# EAGLE schematic fesz_boundary_value_meter (EAGLE 6.5.0)
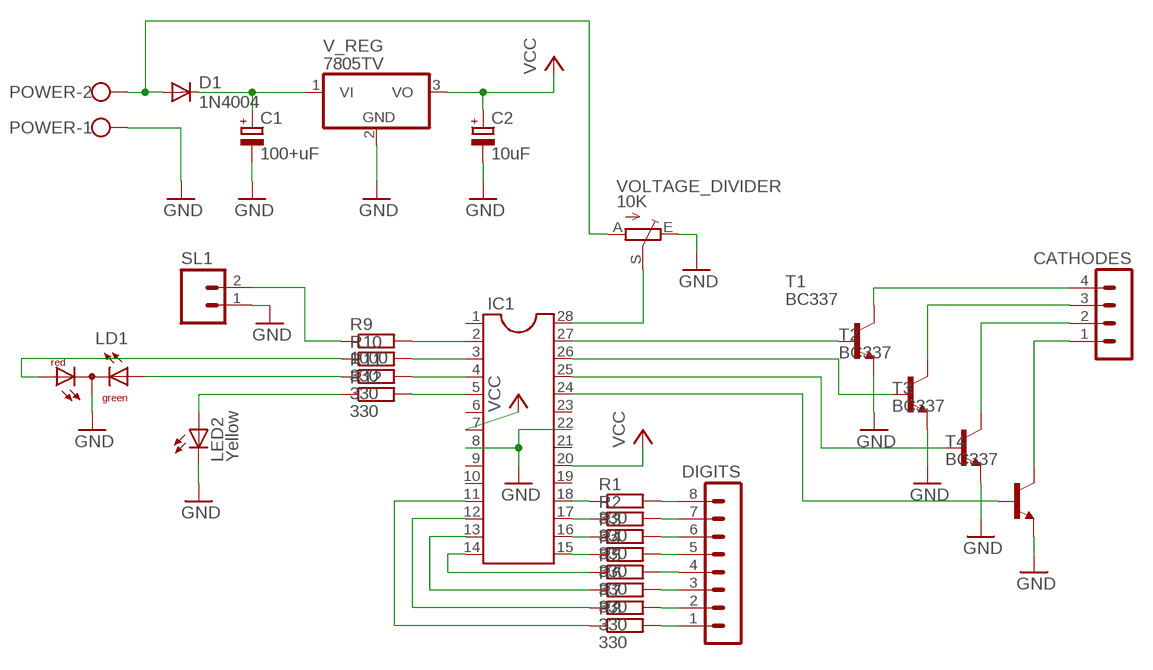
[diagram p0: schematic, sheet 1]

## Parts
C1  100+uF  CPOL-EUE2.5-6  [E2,5-6]
C2  10uF  CPOL-EUE2,5-6E  [E2,5-6E]
CATHODES  MA04-1  [MA04-1]
D1  1N4004  [DO41-10]
DIGITS  MA08-1  [MA08-1]
IC1  DIL28-3  [DIL28-3]
LD1  DUOLED-RG-C  [DUOLED-C-5MM]
LED2  Yellow  LED3MM  [LED3MM]
POWER  W237-102  [W237-102]
R1  330  R-EU_0207/10  [0207/10]
R2  330  R-EU_0207/10  [0207/10]
R3  330  R-EU_0207/10  [0207/10]
R4  330  R-EU_0207/10  [0207/10]
R5  330  R-EU_0207/10  [0207/10]
R6  330  R-EU_0207/10  [0207/10]
R7  330  R-EU_0207/10  [0207/10]
R8  330  R-EU_0207/10  [0207/10]
R9  1000  R-EU_0207/10  [0207/10]
R10  330  R-EU_0207/10  [0207/10]
R11  330  R-EU_0207/10  [0207/10]
R12  330  R-EU_0207/10  [0207/10]
SL1  MA02  [02PA]
T1  BC337  [TO92]
T2  BC337  [TO92]
T3  BC337  [TO92]
T4  BC337  [TO92]
V_REG  7805TV  [TO220V]
VOLTAGE_DIVIDER  10K  TRIM_EU-S64W  [S64W]

## Nets
DIGIT_1_1: IC1.18 R1.1
DIGIT_2_: DIGITS.8 R1.2
DIGIT_2_1: IC1.17 R2.1
DIGIT_2_2: DIGITS.7 R2.2
DIGIT_3_1: IC1.16 R3.1
DIGIT_4_1: IC1.15 R4.1
DIGIT_5_1: IC1.14 R5.1
DIGIT_7_1: IC1.12 R7.1
DIGIT_8_1: IC1.11 R8.1
GND: C1.- C2.- IC1.8 IC1.22 LD1.C LED2.K(C) POWER.1 SL1.1 T1.1(E) T2.1(E) T3.1(E) T4.1(E) V_REG.2(GND) VOLTAGE_DIVIDER.E
N$1: IC1.27 T1.2(B)
N$2: IC1.26 T2.2(B)
N$3: IC1.25 T3.2(B)
N$4: IC1.24 T4.2(B)
N$5: CATHODES.4 T1.3(C)
N$6: CATHODES.3 T2.3(C)
N$7: DIGITS.3 R6.2
N$8: CATHODES.2 T3.3(C)
N$9: CATHODES.1 T4.3(C)
N$10: DIGITS.6 R3.2
N$11: DIGITS.5 R4.2
N$12: DIGITS.4 R5.2
N$13: DIGITS.1 R8.2
N$14: LD1.AR R10.1
N$15: IC1.28 VOLTAGE_DIVIDER.S
N$16: IC1.13 R6.1
N$17: DIGITS.2 R7.2
N$18: IC1.2 R9.2
N$19: IC1.3 R10.2
N$20: R9.1 SL1.2
N$22: IC1.4 R11.2
N$23: IC1.5 R12.2
N$24: LD1.AX(AG) R11.1
N$25: LED2.A R12.1
V_IN_MEASURE: D1.A POWER.2 VOLTAGE_DIVIDER.A
V_IN_SUPPLY: C1.+ D1.C V_REG.1(VI)
VCC: C2.+ IC1.7 IC1.20 V_REG.3(VO)
Unconnected: IC1.1 IC1.6 IC1.9 IC1.10 IC1.19 IC1.21 IC1.23

## Library data of the parts
C1 C2 = rcl:CPOL-EU: POLARIZED CAPACITOR, European symbol
CATHODES = con-lstb:MA04-1: PIN HEADER; OC_FARNELL: unknown; OC_NEWARK: unknown
D1 = diode:1N4004: DIODE general purpose rectifier, 1 A
DIGITS = con-lstb:MA08-1: PIN HEADER; OC_FARNELL: unknown; OC_NEWARK: unknown
IC1 = ic-package:DIL28: Dual In Line
LD1 = led:DUOLED-RG-C: DUO LED 2 colors (red/green), 5 mm, round, common Cathode www.ligitek.com or other producers.
LED2 = led:LED: LED OSRAM: - CHIPLED LG R971, LG N971, LY N971, LG Q971, LY Q971, LO R971, LY R971 LH N974, LH R974 LS Q976, LO Q976, LY Q976 LO Q996 - Hyper CHIPLED LW Q18S LB Q993, LB Q99A, LB R99A - SideLED LS A670, LO A670, LY A670, LG A670, LP A670 LB A673, LV A673, LT A673, LW A673 LH A674 LY A675 LS A676, LA A676, LO A676, LY A676, LW A676 LS A679, LY A679, LG A679 - Hyper Micro SIDELED® LS Y876, LA Y876, LO Y876, LY Y876 LT Y87S - SmartLED LW L88C, LW L88S LB L89C, LB L89S, LG L890 LS L89K, LO L89K, LY L89K LS L896, LA L896, LO L896, LY L896 - TOPLED LS T670, LO T670, LY T670, LG T670, LP T670 LSG T670, LSP T670, LSY T670, LOP T670, LYG T670 LG T671, LOG T671, LSG T671 LB T673, LV T673, LT T673, LW T673 LH T674 LS T676, LA T676, LO T676, LY T676, LB T676, LH T676, LSB T676, LW T676 LB T67C, LV T67C, LT T67C, LS T67K, LO T67K, LY T67K, LW E67C LS E67B, LA E67B, LO E67B, LY E67B, LB E67C, LV E67C, LT E67C LW T67C LS T679, LY T679, LG T679 LS T770, LO T770, LY T770, LG T770, LP T770 LB T773, LV T773, LT T773, LW T773 LH T774 LS E675, LA E675, LY E675, LS T675 LS T776, LA T776, LO T776, LY T776, LB T776 LHGB T686 LT T68C, LB T68C - Hyper Mini TOPLED® LB M676 - Mini TOPLED Santana® LG M470 LS M47K, LO M47K, LY M47K Source: http://www.osram.convergy.de LUXEON: - LUMILED® LXK2-PW12-R00, LXK2-PW12-S00, LXK2-PW14-U00, LXK2-PW14-V00 LXK2-PM12-R00, LXK2-PM12-S00, LXK2-PM14-U00 LXK2-PE12-Q00, LXK2-PE12-R00, LXK2-PE12-S00, LXK2-PE14-T00, LXK2-PE14-U00 LXK2-PB12-K00, LXK2-PB12-L00, LXK2-PB12-M00, LXK2-PB14-N00, LXK2-PB14-P00, LXK2-PB14-Q00 LXK2-PR12-L00, LXK2-PR12-M00, LXK2-PR14-Q00, LXK2-PR14-R00 LXK2-PD12-Q00, LXK2-PD12-R00, LXK2-PD12-S00 LXK2-PH12-R00, LXK2-PH12-S00 LXK2-PL12-P00, LXK2-PL12-Q00, LXK2-PL12-R00 Source: www.luxeon.com KINGBRIGHT: KA-3528ASYC Source: www.kingbright.com
POWER = con-wago-500:W237-102: WAGO SCREW CLAMP; MPN: 237-102; OC_FARNELL: unknown; OC_NEWARK: 70K9898
R1-R12 = rcl:R-EU_: RESISTOR, European symbol
SL1 = con-amp-quick:MA02: AMP QUICK CONNECTOR; OC_FARNELL: unknown; OC_NEWARK: unknown
T1-T4 = transistor-neu-to92:BC337: NPN TRANSISTOR
V_REG = linear:78*: Positive VOLTAGE REGULATOR Source: http://cache.national.com/ds/LM/LM78L05.pdf http://www.fairchildsemi.com/ds/LM/LM7805.pdf
VOLTAGE_DIVIDER = pot:TRIM_EU-: POTENTIOMETER